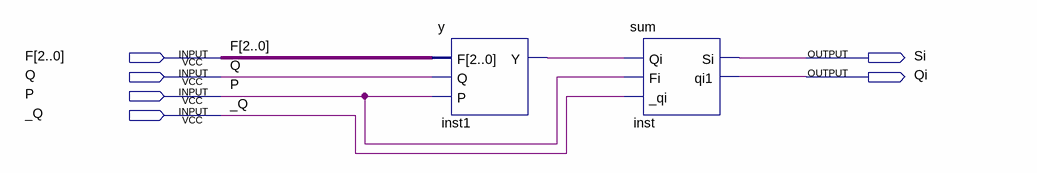
[diagram p0: schematic sheet]
// Quartus schematic LN.bdf as structural Verilog: 2 symbols, 6 pins
module LN (
  input  [2:0] F,
  input  Q,
  input  P,
  input  _Q,
  output Si,
  output Qi
);

  wire inst1_y;

  y inst1 (.F(F), .Q(Q), .P(P), .Y(inst1_y));
  sum inst (.Qi(inst1_y), .Fi(P), ._qi(_Q), .Si(Si), .qi1(Qi));
endmodule
